# EAGLE design CMCD_and_buckmod_FINAL (EAGLE 6.2)

## Sheet 1 of 2
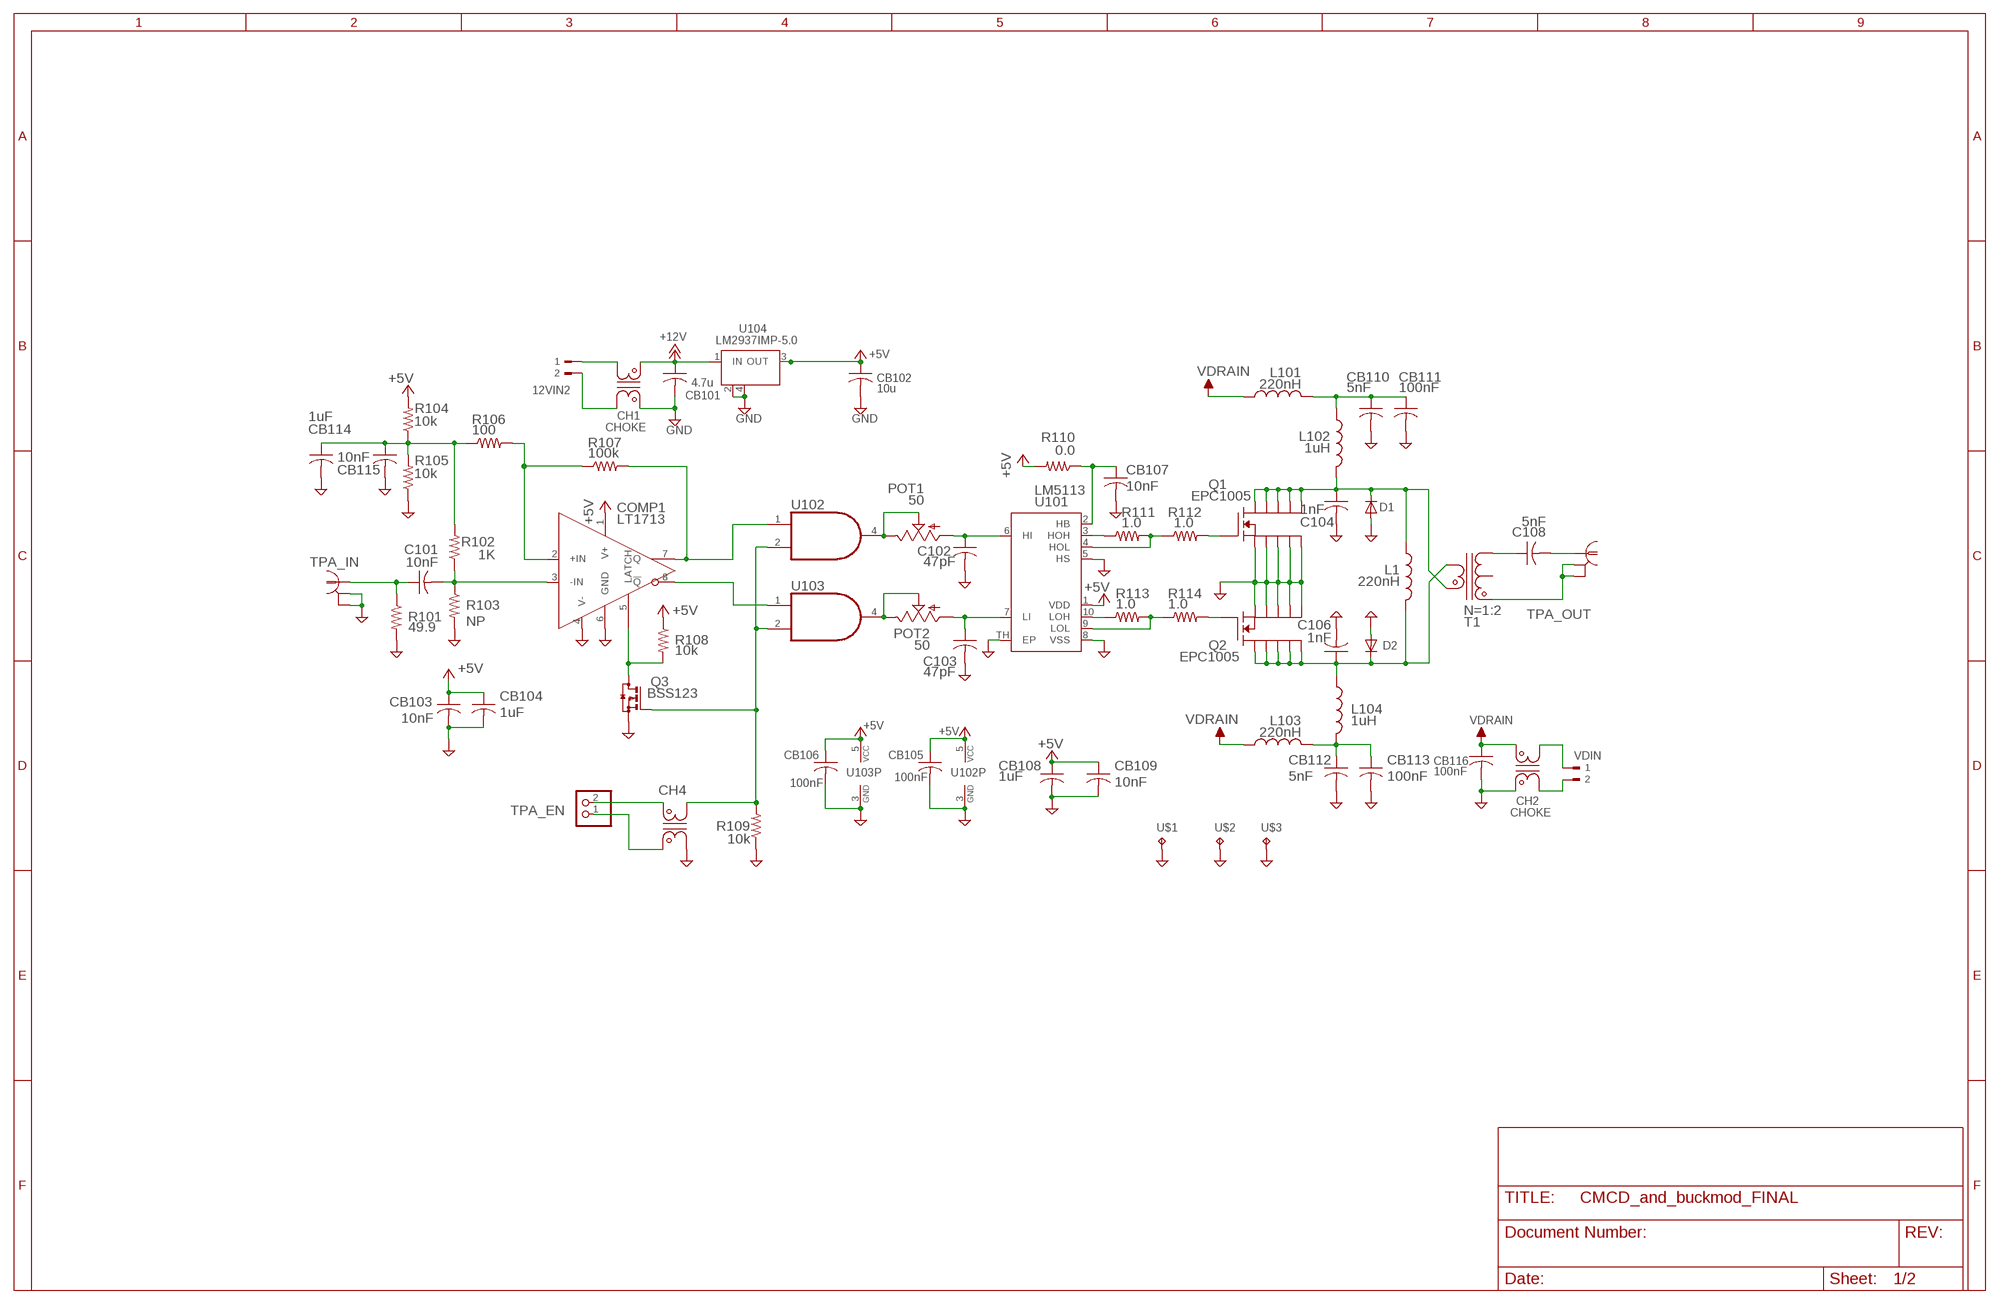
[diagram p0: schematic, sheet 1]

### Parts
12VIN2  TERM-2OMNIMATE_SL  [OMNIMATE_SL_2POS]
C101  10nF  C-USC0805  [C0805]
C102  47pF  C-USC0805  [C0805]
C103  47pF  C-USC0805  [C0805]
C104  1nF  CAPACITOR1008  [1008]
C106  1nF  CAPACITOR1008  [1008]
C108  5nF  CAPACITOR1008  [1008]
CB101  4.7u  C-USC0805  [C0805]
CB102  10u  C-USC0805  [C0805]
CB103  10nF  C-USC0603  [C0603]
CB104  1uF  C-USC0603  [C0603]
CB105  100nF  C-USC0603  [C0603]
CB106  100nF  C-USC0603  [C0603]
CB107  10nF  C-USC0603  [C0603]
CB108  1uF  C-USC0603  [C0603]
CB109  10nF  C-USC0603  [C0603]
CB110  5nF  CAPACITOR1008  [1008]
CB111  100nF  C-USC0805  [C0805]
CB112  5nF  CAPACITOR1008  [1008]
CB113  100nF  C-USC0805  [C0805]
CB114  1uF  C-USC0805  [C0805]
CB115  10nF  C-USC0603  [C0603]
CB116  100nF  C-USC0805  [C0805]
CH1  CHOKE  [CHOKE_DLW5BT]
CH2  CHOKE  [CHOKE_DLW5BT]
CH4  CHOKEDLW31S  [CHOKE_DLW31S]
COMP1  LT1713  [MSOP-8]
D1  DIODE-DO214AC  [DO214AC]
D2  DIODE-DO214AC  [DO214AC]
L1  220nH  INDUCTOR  [GENERAL-1]
L101  220nH  INDUCTOR  [GENERAL-1]
L102  1uH  INDUCTOR  [GENERAL-1]
L103  220nH  INDUCTOR  [GENERAL-1]
L104  1uH  INDUCTOR  [GENERAL-1]
POT1  50  TRIM_US-3223W  [3223W]
POT2  50  TRIM_US-3223W  [3223W]
Q1  EPC1005  [11-LGA]
Q2  EPC1005  [11-LGA]
Q3  BSS123  [SOT23]
R101  49.9  R-US_R0805  [R0805]
R102  1K  R-US_R0805  [R0805]
R103  NP  R-US_R0805  [R0805]
R104  10k  R-US_R0805  [R0805]
R105  10k  R-US_R0805  [R0805]
R106  100  R-US_R0805  [R0805]
R107  100k  R-US_R0805  [R0805]
R108  10k  R-US_R0805  [R0805]
R109  10k  R-US_R0805  [R0805]
R110  0.0  R-US_R0603  [R0603]
R111  1.0  R-US_R0603  [R0603]
R112  1.0  R-US_R0603  [R0603]
R113  1.0  R-US_R0603  [R0603]
R114  1.0  R-US_R0603  [R0603]
T1  N=1:2  BALUN_2:1BALUN_CUSTOM_BIG  [BALUN_GENERAL_BIG]
TPA_EN  PINHD-1X2  [1X02]
TPA_IN  BNC-EDGE  [BNC-EDGE]
TPA_OUT  BNC-EDGE  [BNC-EDGE]
U101  LM5113  [LLP-10]
U102  74AHC1G08DBV  [SOT23-5]
U103  74AHC1G08DBV  [SOT23-5]
U104  LM2937IMP-5.0  LM340S  [SOT223]
U$1  TESTPOINTKEYSTONE_ELECTRONICS_5016  [SMD_TESTPAD]
U$2  TESTPOINTKEYSTONE_ELECTRONICS_5016  [SMD_TESTPAD]
U$3  TESTPOINTKEYSTONE_ELECTRONICS_5016  [SMD_TESTPAD]
VDIN  TERM-2OMNIMATE_SL  [OMNIMATE_SL_2POS]

### Nets
+5V: CB102.1 CB103.1 CB104.1 CB105.1 CB106.1 CB108.1 CB109.1 COMP1.1(V+) R104.2 R108.1 R110.2 U101.1(VDD) U102.5(VCC) U103.5(VCC) U104.3(OUT) ; also sheet 2
+12V: CB101.1 CH1.P$4 U104.1(IN) ; also sheet 2
GND: C102.2 C103.2 C104.P$2 C106.P$2 CB101.2 CB102.2 CB103.2 CB104.2 CB105.2 CB106.2 CB107.2 CB108.2 CB109.2 CB110.P$2 CB111.2 CB112.P$2 CB113.2 CB114.2 CB115.2 CB116.2 CH1.P$1 CH2.P$1 CH4.P$2 COMP1.4(V-) COMP1.6(GND) D1.A D2.A Q1.2(S1) Q1.4(S2) Q1.6(S3) Q1.8(S4) Q1.10(S5) Q2.2(S1) Q2.4(S2) Q2.6(S3) Q2.8(S4) Q2.10(S5) Q3.2(S) R101.2 R103.2 R105.1 R109.1 TPA_IN.S1(GND1) TPA_IN.S2(GND2) U101.5(HS) U101.8(VSS) U101.TH(EP) U102.3(GND) U103.3(GND) U104.2(GND) U104.4(GND) U$1.P$1(TP) U$2.P$1(TP) U$3.P$1(TP) ; also sheet 2
N$1: R111.1 U101.3(HOH)
N$2: R111.2 R112.1 U101.4(HOL)
N$3: R113.1 U101.10(LOH)
N$4: R113.2 R114.1 U101.9(LOL)
N$5: Q2.1(G) R114.2
N$6: Q1.1(G) R112.2
N$7: CB107.1 R110.1 U101.2(HB)
N$8: COMP1.7(Q) R107.2 U102.1(I0)
N$9: POT1.2(S) POT1.3(E) U102.4(O)
N$10: POT2.2(S) POT2.3(E) U103.4(O)
N$11: CB114.1 CB115.1 R102.2 R104.1 R105.2 R106.1
N$12: COMP1.8(!Q) U103.1(I0)
N$13: COMP1.5(LATCH) Q3.3(D) R108.2
N$14: T1.S1 TPA_OUT.S1(GND1) TPA_OUT.S2(GND2)
N$15: C102.1 POT1.1(A) U101.6(HI)
N$16: COMP1.2(+IN) R106.2 R107.1
N$17: C101.2 COMP1.3(-IN) R102.1 R103.1
N$18: C101.1 R101.1 TPA_IN.I
N$19: CH4.P$3 Q3.1(G) R109.2 U102.2(I1) U103.2(I1)
N$22: CH2.P$3 VDIN.1
N$23: CH2.P$2 VDIN.2
N$24: C106.P$1 D2.C L1.P$2 L104.P$1 Q2.3(D1) Q2.5(D2) Q2.7(D3) Q2.9(D4) Q2.11(D5) T1.P2
N$25: C103.1 POT2.1(A) U101.7(LI)
N$26: C104.P$1 D1.C L1.P$1 L102.P$2 Q1.3(D1) Q1.5(D2) Q1.7(D3) Q1.9(D4) Q1.11(D5) T1.P1
N$27: CB110.P$1 CB111.1 L101.P$2 L102.P$1
N$28: CB112.P$1 CB113.1 L103.P$2 L104.P$2
N$29: C108.P$2 TPA_OUT.I
N$31: C108.P$1 T1.S2
N$33: 12VIN2.1 CH1.P$3
N$34: 12VIN2.2 CH1.P$2
N$39: CH4.P$4 TPA_EN.2
N$40: CH4.P$1 TPA_EN.1
VDRAIN: CB116.1 CH2.P$4 L101.P$1 L103.P$1
Unconnected: T1.CT

## Sheet 2 of 2
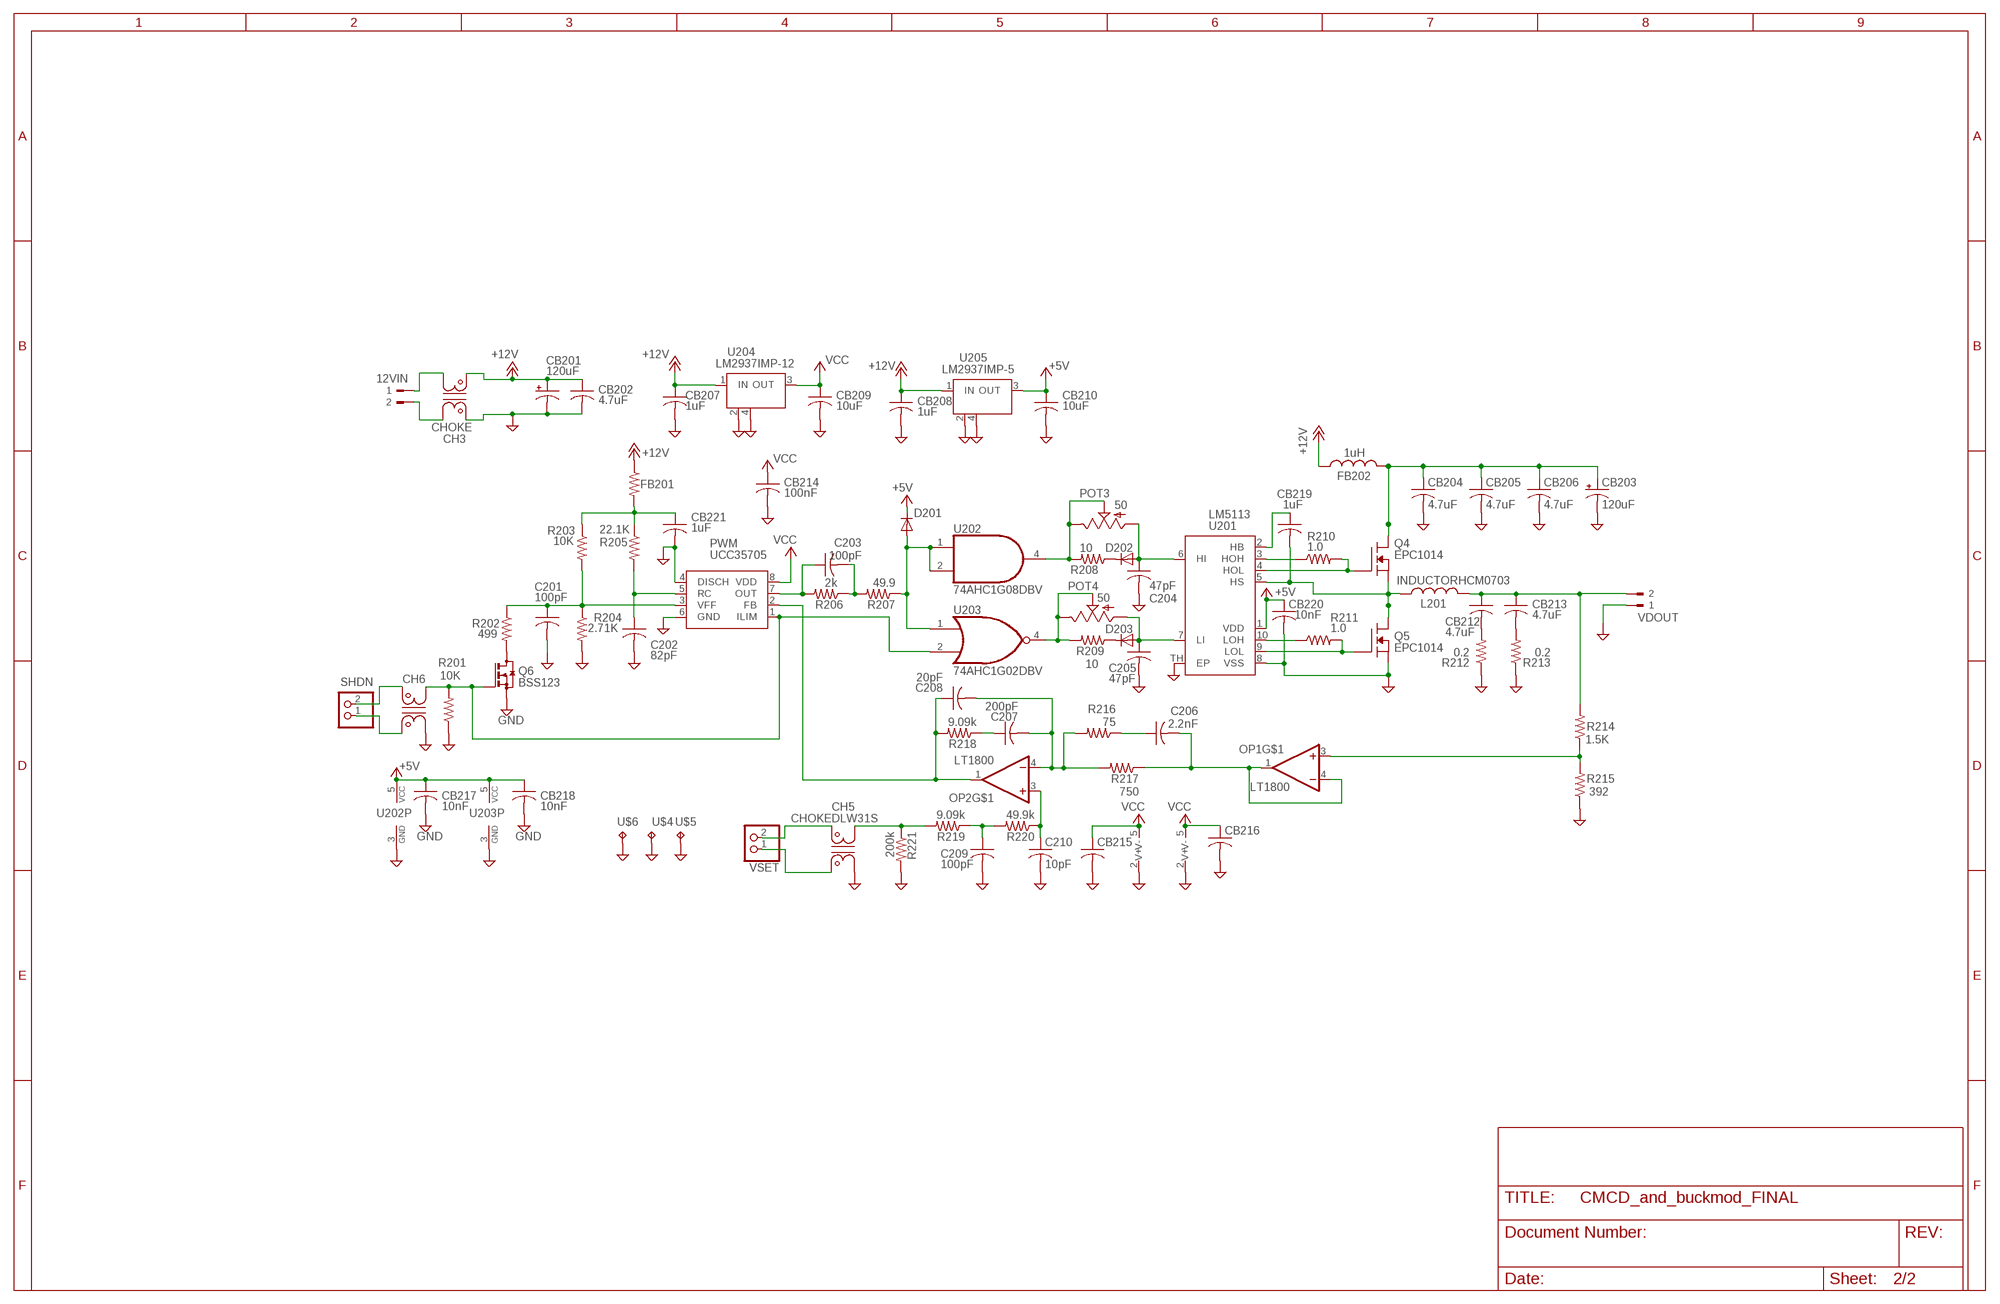
[diagram p1: schematic, sheet 2]

### Parts
12VIN  TERM-2OMNIMATE_SL  [OMNIMATE_SL_2POS]
C201  100pF  C-USC0805  [C0805]
C202  82pF  C-USC0805  [C0805]
C203  100pF  C-USC0805  [C0805]
C204  47pF  C-USC0603  [C0603]
C205  47pF  C-USC0603  [C0603]
C206  2.2nF  C-USC0805  [C0805]
C207  200pF  C-USC0805  [C0805]
C208  20pF  C-USC0805  [C0805]
C209  100pF  C-USC0805  [C0805]
C210  10pF  C-USC0805  [C0805]
CB201  120uF  CPOL-USE3.5-8  [E3,5-8]
CB202  4.7uF  C-USC0805  [C0805]
CB203  120uF  CPOL-USE3.5-8  [E3,5-8]
CB204  4.7uF  C-USC0805  [C0805]
CB205  4.7uF  CAPACITOR1206-LONG  [1206-LONG]
CB206  4.7uF  CAPACITOR1206-LONG  [1206-LONG]
CB207  1uF  C-USC0805  [C0805]
CB208  1uF  C-USC0805  [C0805]
CB209  10uF  C-USC0805  [C0805]
CB210  10uF  C-USC0805  [C0805]
CB212  4.7uF  C-USC0805  [C0805]
CB213  4.7uF  C-USC0805  [C0805]
CB214  100nF  C-USC0603  [C0603]
CB215  C-USC0603  [C0603]
CB216  C-USC0603  [C0603]
CB217  10nF  C-USC0603  [C0603]
CB218  10nF  C-USC0603  [C0603]
CB219  1uF  C-USC0603  [C0603]
CB220  10nF  C-USC0603  [C0603]
CB221  1uF  C-USC0805  [C0805]
CH3  CHOKE  [CHOKE_DLW5BT]
CH5  CHOKEDLW31S  [CHOKE_DLW31S]
CH6  CHOKEDLW31S  [CHOKE_DLW31S]
D201  DIODE-SOD323-W  [SOD323-W]
D202  DIODE-SOD323-W  [SOD323-W]
D203  DIODE-SOD323-W  [SOD323-W]
FB201  R-US_R0805  [R0805]
FB202  1uH  INDUCTOR1008  [1008]
L201  INDUCTORHCM0703  [HCM0703]
OP1  LT1800  LMH6624  [SOT23-5]
OP2  LT1800  LMH6624  [SOT23-5]
POT3  50  TRIM_US-3223W  [3223W]
POT4  50  TRIM_US-3223W  [3223W]
PWM  UCC35705  [MSOP-8]
Q4  EPC1014  [5-LGA]
Q5  EPC1014  [5-LGA]
Q6  BSS123  [SOT23]
R201  10K  R-US_R0805  [R0805]
R202  499  R-US_R0805  [R0805]
R203  10K  R-US_R0805  [R0805]
R204  2.71K  R-US_R0805  [R0805]
R205  22.1K  R-US_R0805  [R0805]
R206  2k  R-US_R0805  [R0805]
R207  49.9  R-US_R0805  [R0805]
R208  10  R-US_R0805  [R0805]
R209  10  R-US_R0805  [R0805]
R210  1.0  R-US_R0603  [R0603]
R211  1.0  R-US_R0603  [R0603]
R212  0.2  R-US_R0805  [R0805]
R213  0.2  R-US_R0805  [R0805]
R214  1.5K  R-US_R0805  [R0805]
R215  392  R-US_R0805  [R0805]
R216  75  R-US_R0805  [R0805]
R217  750  R-US_R0805  [R0805]
R218  9.09k  R-US_R0805  [R0805]
R219  9.09k  R-US_R0805  [R0805]
R220  49.9k  R-US_R0805  [R0805]
R221  200k  R-US_R0805  [R0805]
SHDN  PINHD-1X2  [1X02]
U201  LM5113  [LLP-10]
U202  74AHC1G08DBV  [SOT23-5]
U203  74AHC1G02DBV  [SOT23-5]
U204  LM2937IMP-12  LM340S  [SOT223]
U205  LM2937IMP-5  LM340S  [SOT223]
U$4  TESTPOINTKEYSTONE_ELECTRONICS_5016  [SMD_TESTPAD]
U$5  TESTPOINTKEYSTONE_ELECTRONICS_5016  [SMD_TESTPAD]
U$6  TESTPOINTKEYSTONE_ELECTRONICS_5016  [SMD_TESTPAD]
VDOUT  TERM-2OMNIMATE_SL  [OMNIMATE_SL_2POS]
VSET  PINHD-1X2  [1X02]

### Nets
+5V: CB210.1 CB217.1 CB218.1 CB220.1 D201.C U201.1(VDD) U202.5(VCC) U203.5(VCC) U205.3(OUT) ; also sheet 1
+12V: CB201.+ CB202.1 CB207.1 CB208.1 CH3.P$4 FB201.1 FB202.P$1 U204.1(IN) U205.1(IN) ; also sheet 1
+VIN: CB203.+ CB204.1 CB205.1 CB206.1 FB202.P$2 Q4.3(D) Q4.5(D1)
GND: C201.2 C202.2 C204.2 C205.2 C209.2 C210.2 CB201.- CB202.2 CB203.- CB204.2 CB205.2 CB206.2 CB207.2 CB208.2 CB209.2 CB210.2 CB214.2 CB215.2 CB216.2 CB217.2 CB218.2 CB220.2 CB221.2 CH3.P$1 CH5.P$2 CH6.P$2 OP1.2(V-) OP2.2(V-) PWM.4(DISCH) PWM.6(GND) Q5.2(S1) Q5.4(S2) Q6.2(S) R201.1 R204.2 R212.1 R213.1 R215.1 R221.2 U201.8(VSS) U201.TH(EP) U202.3(GND) U203.3(GND) U204.2(GND) U204.4(GND) U205.2(GND) U205.4(GND) U$4.P$1(TP) U$5.P$1(TP) U$6.P$1(TP) VDOUT.1 ; also sheet 1
N$20: 12VIN.2 CH3.P$2
N$21: 12VIN.1 CH3.P$3
N$30: R210.1 U201.3(HOH)
N$32: Q4.1(G) R210.2 U201.4(HOL)
N$35: CH5.P$4 VSET.2
N$36: CH5.P$1 VSET.1
N$37: CH6.P$4 SHDN.2
N$38: CH6.P$1 SHDN.1
N$45: R211.1 U201.10(LOH)
N$81: Q5.1(G) R211.2 U201.9(LOL)
N$82: CB219.2 L201.P$1 Q4.2(S1) Q4.4(S2) Q5.3(D) Q5.5(D1) U201.5(HS)
N$83: C205.1 D203.A POT4.1(A) U201.7(LI)
N$84: C204.1 D202.A POT3.1(A) U201.6(HI)
N$85: POT4.2(S) POT4.3(E) R209.2 U203.4(O)
N$86: CB219.1 U201.2(HB)
N$87: C208.1 OP2.1(OUT) PWM.2(FB) R218.2
N$88: C207.2 C208.2 OP2.4(-IN) R216.2 R217.2
N$89: C207.1 R218.1
N$90: C206.1 R216.1
N$91: C206.2 OP1.1(OUT) OP1.4(-IN) R217.1
N$92: CB213.2 R213.2
N$93: CB212.1 CB213.1 L201.P$2 R214.2 VDOUT.2
N$94: OP1.3(+IN) R214.1 R215.2
N$96: C209.1 R219.1 R220.2
N$97: CB212.2 R212.2
N$104: CH5.P$3 R219.2 R221.1
N$107: D201.A R207.1 U202.1(I0) U202.2(I1) U203.1(I0)
N$108: C202.1 PWM.5(RC) R205.2
N$109: C201.1 PWM.3(VFF) R202.1 R203.2 R204.1
N$111: C203.1 PWM.7(OUT) R206.2
N$112: C203.2 R206.1 R207.2
N$113: Q6.3(D) R202.2
N$114: CB221.1 FB201.2 R203.1 R205.1
N$116: D203.C R209.1
N$117: D202.C R208.1
N$129: POT3.2(S) POT3.3(E) R208.2 U202.4(O)
N$135: CH6.P$3 PWM.1(ILIM) Q6.1(G) R201.2 U203.2(I1)
OP2: C210.1 OP2.3(+IN) R220.1
VCC: CB209.1 CB214.1 CB215.1 CB216.1 OP1.5(V+) OP2.5(V+) PWM.8(VDD) U204.3(OUT)

## Library data of the parts
12VIN 12VIN2 VDIN VDOUT = amyparts-rf-combined:TERM-2
C101-C103 C201-C210 CB101-CB109 CB111 CB113-CB116 CB202 CB204 CB207-CB210 CB212-CB221 = rcl:C-US: CAPACITOR, American symbol
C104 C106 C108 CB110 CB112 CB205 CB206 = amyparts-rf-combined:CAPACITOR
CB201 CB203 = rcl:CPOL-US: POLARIZED CAPACITOR, American symbol
CH1-CH6 = amyparts-rf-combined:CHOKE
COMP1 = amyparts-rf-combined:LT1713
D1 D2 D201-D203 = diode:DIODE-: DIODE
FB201 R101-R114 R201-R221 = rcl:R-US_: RESISTOR, American symbol
FB202 = amyparts-rf:INDUCTOR
L1 L101-L104 L201 = amyparts-rf-combined:INDUCTOR
OP1 OP2 = amyparts-rf:LMH6624
POT1-POT4 = amyparts-rf-combined:TRIM_US-: POTENTIOMETER
PWM = amyparts-rf-combined:UCC35705
Q1 Q2 = amyparts-rf-combined:EPC1005
Q3 Q6 = transistor-small-signal:BSS123: N-CHANNEL MOS FET
Q4 Q5 = amyparts-rf:EPC1014
SHDN TPA_EN VSET = pinhead:PINHD-1X2: PIN HEADER
T1 = amyparts-rf-combined:BALUN_2:1
TPA_IN TPA_OUT = amyparts-rf-combined:BNC-EDGE
U101 = amyparts-rf-combined:LM5113
U102 U103 U202 = 74xx-little-us:74*1G08: 2-input AND gate
U104 U204 U205 = linear:LM340S: 3-Terminal Positive Regulators Source: http://cache.national.com/ds/LM/LM340.pdf
U201 = amyparts-rf:LM5113
U203 = 74xx-little-us:74*1G02: 2-input NOR gate
U$1-U$6 = amyparts-rf-combined:TESTPOINT

## Board
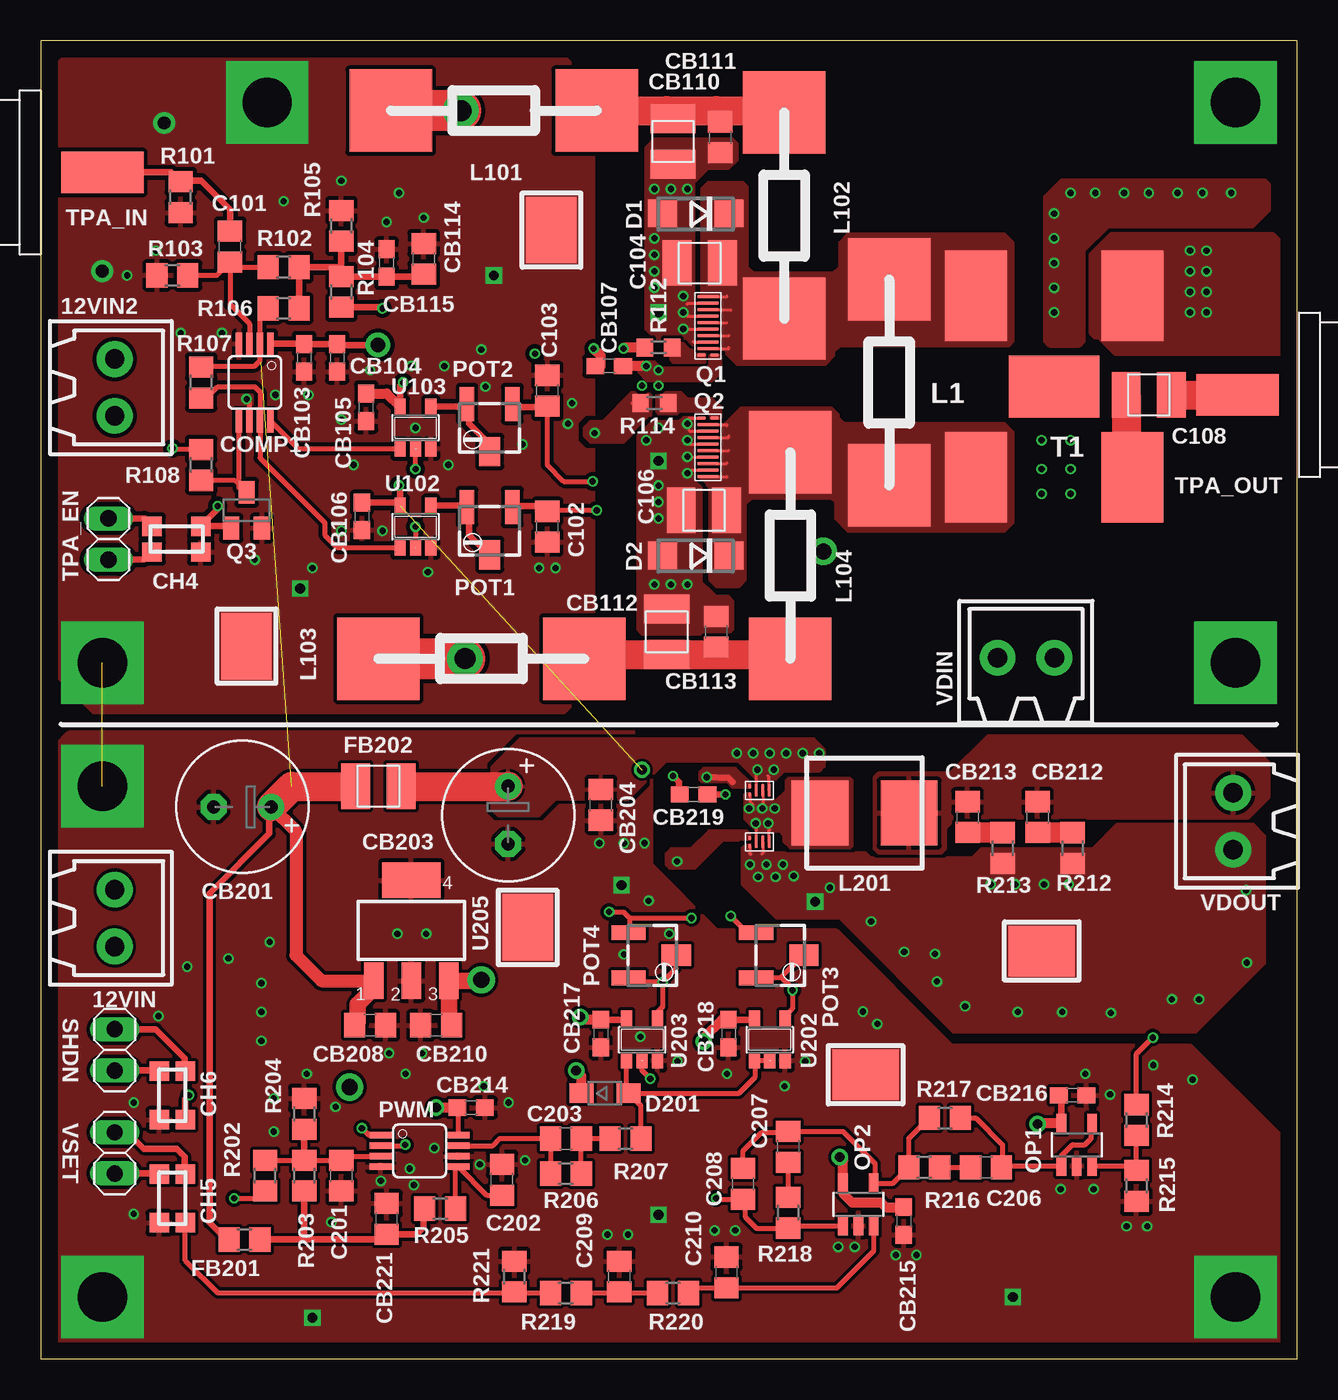
[diagram p2: board, top side]
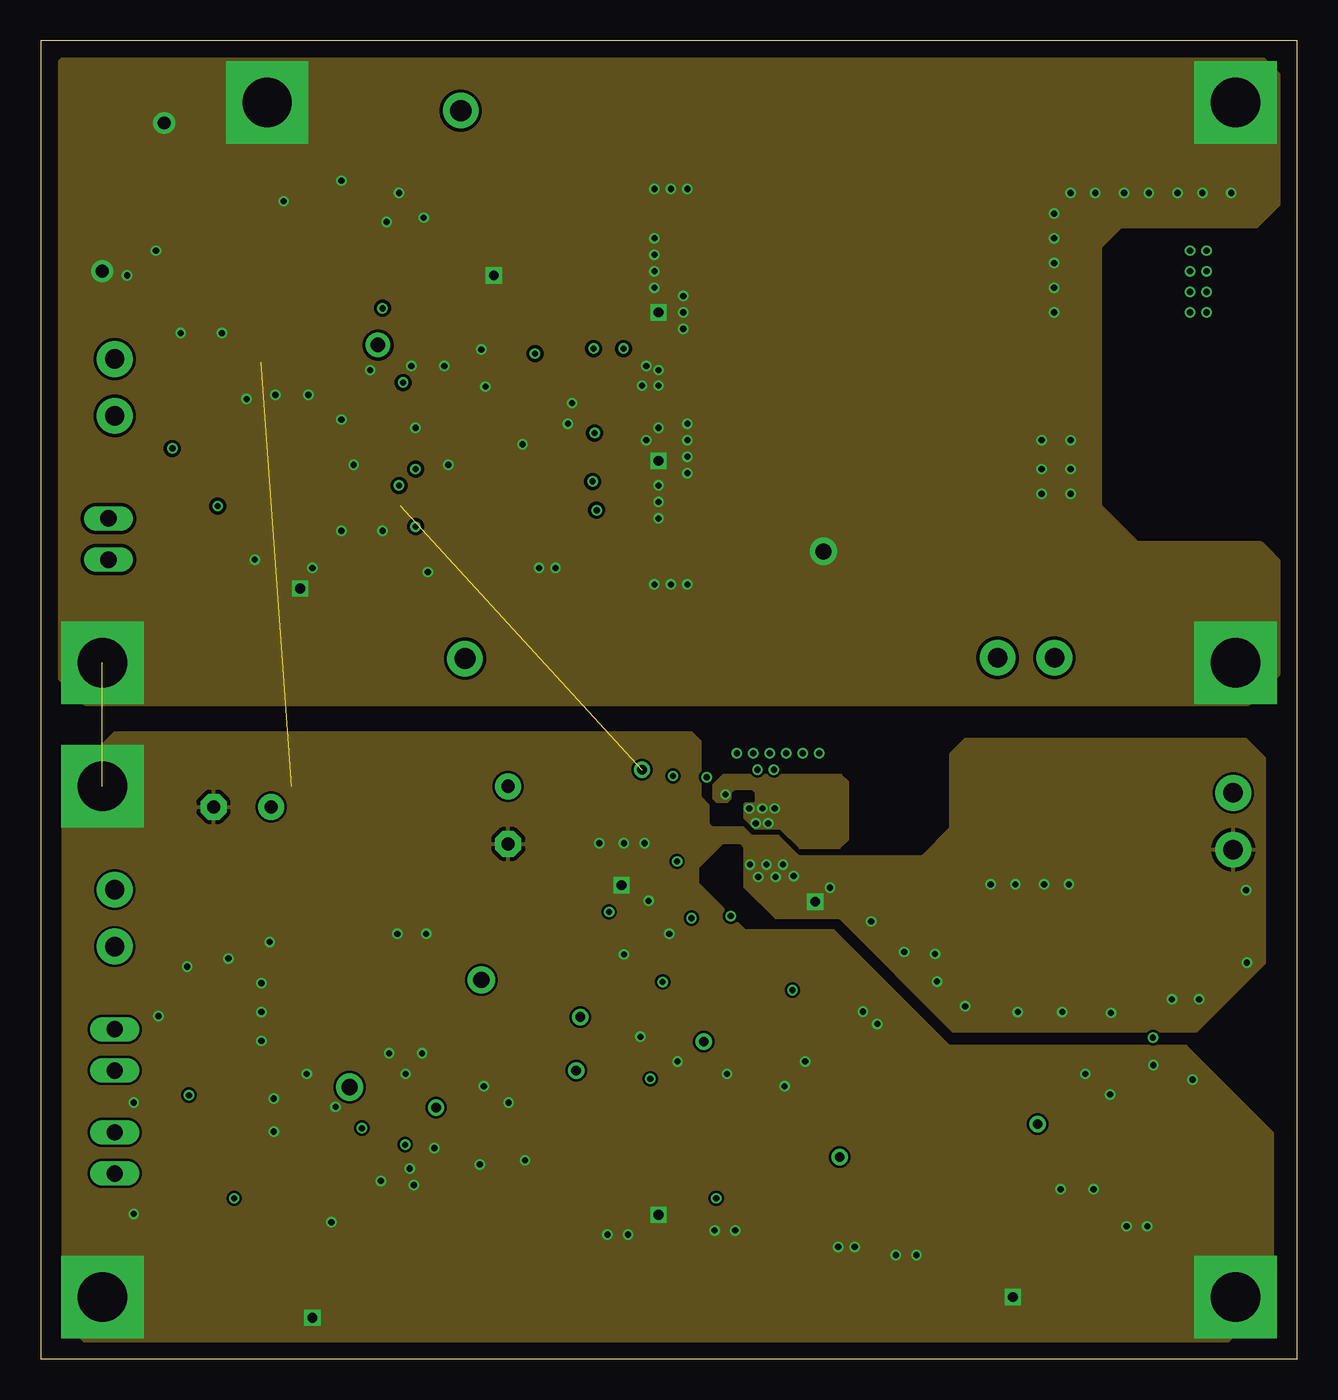
[diagram p3: board, inner layer Route2]
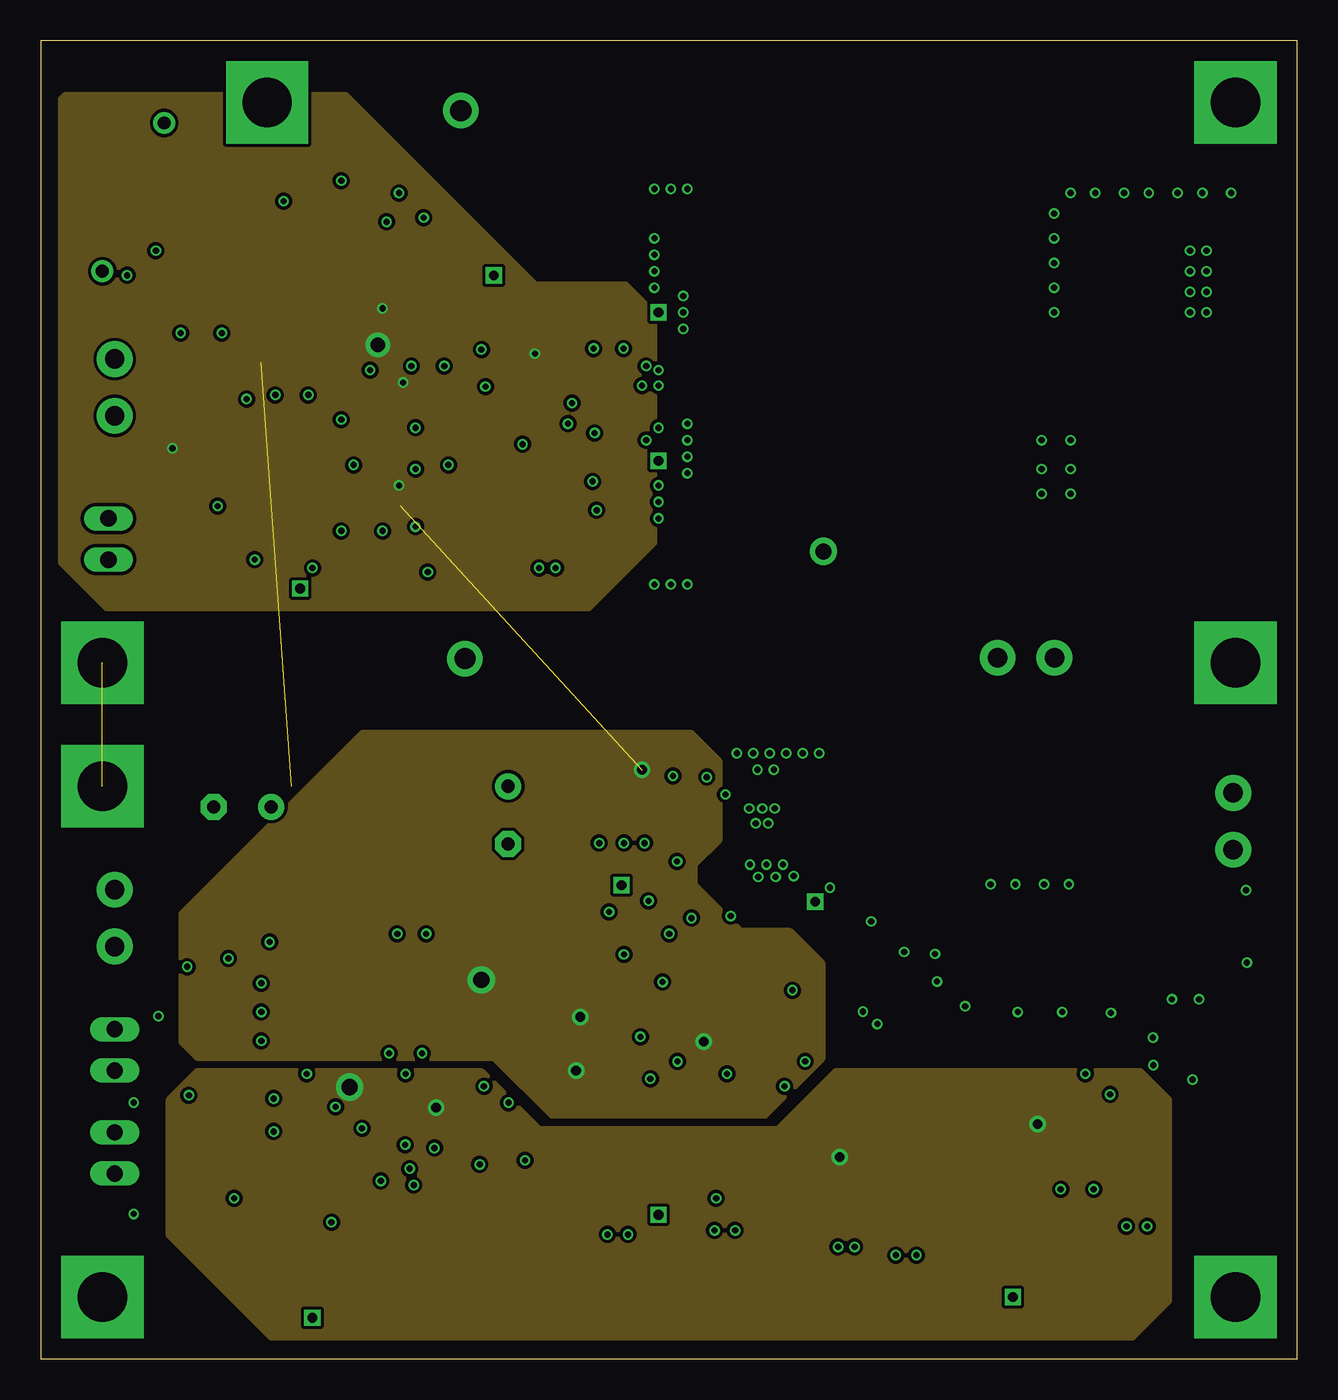
[diagram p4: board, inner layer Route15]
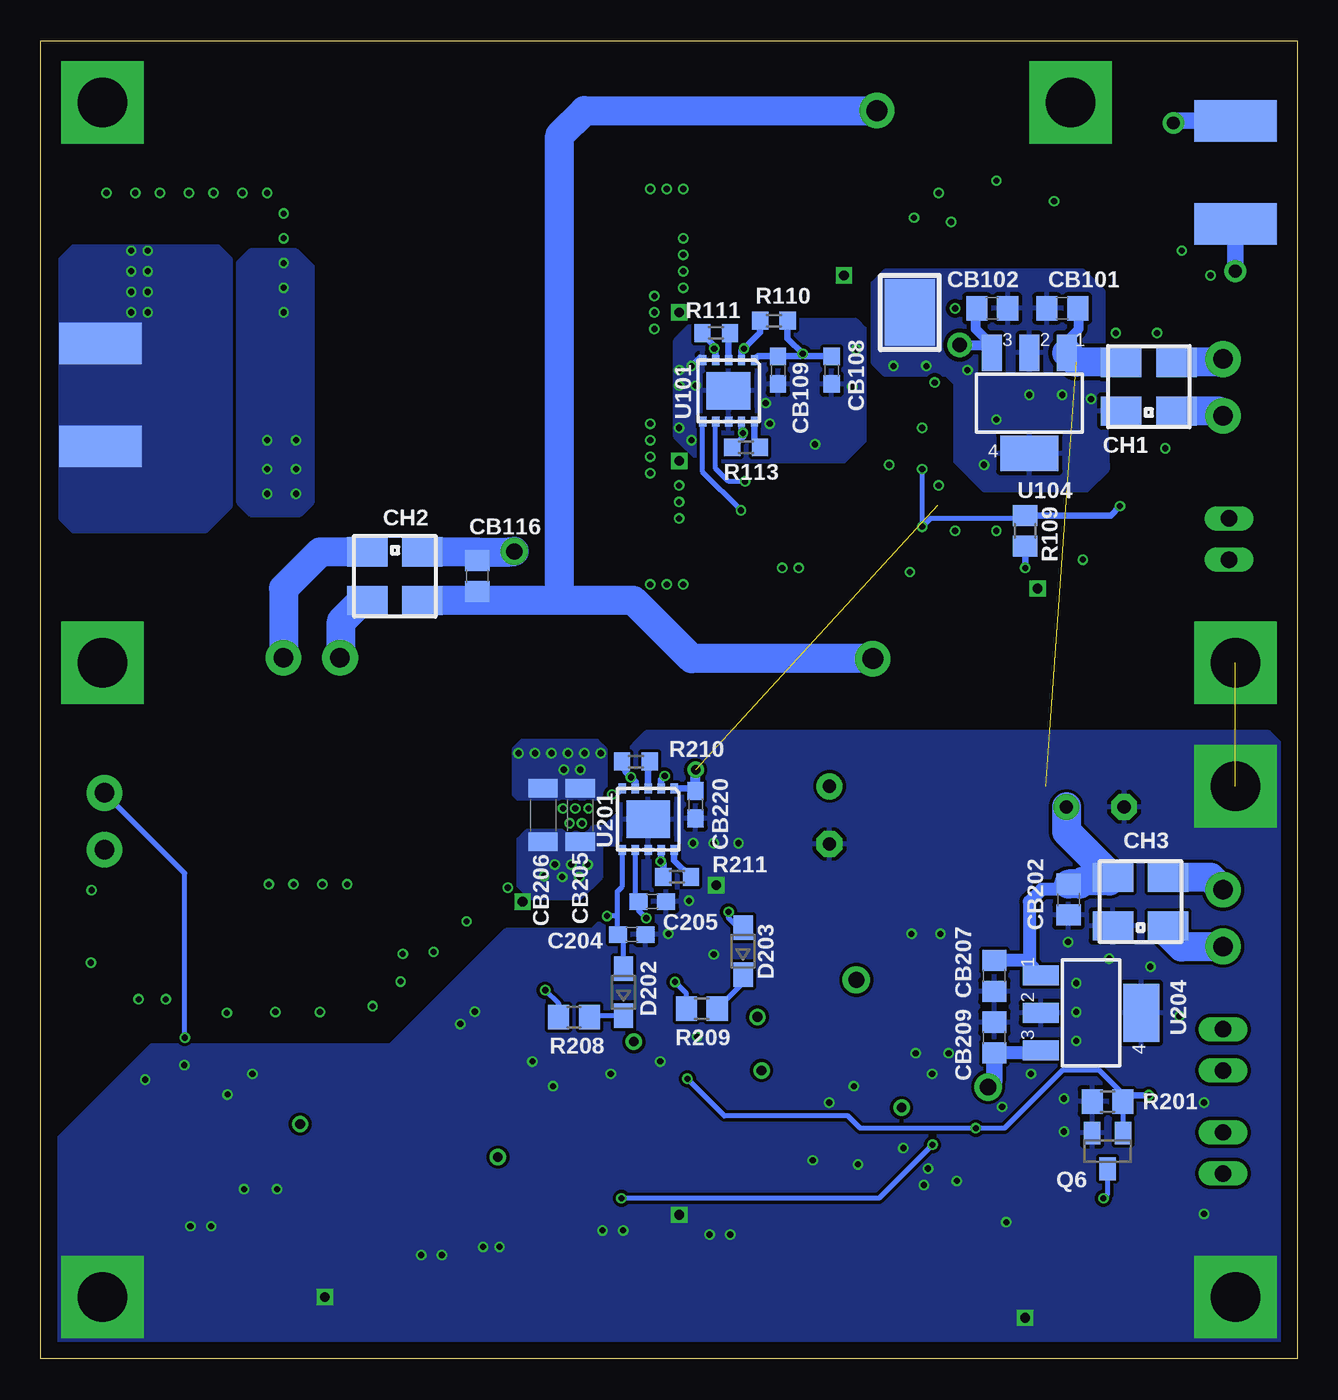
[diagram p5: board, bottom side, seen from below]

Size 77.47 x 81.28 mm. Coordinates in mm from the lower left corner, seen from the top.
Outline: 0,0 77.47,0 77.47,81.28 0,81.28 0,0
Copper layers (1*2+15*16): Top 0.035mm / dielectric 1.5mm / Route2 0.035mm / dielectric 0.15mm / Route15 0.035mm / dielectric 0.2mm / Bottom 0.035mm
Design rules: minimum track width 7mil, minimum drill 15mil, track to track 6mil, track to pad 6mil, pad to pad 6mil, via to via 6mil, smd to smd 1mil, copper to edge 40mil, drill to drill 8mil, minimum pad ring 7mil, minimum via ring 5mil, stop-mask expansion 4mil, vias tented up to drill 15mil, thermal gap 10mil

### Footprints (pad centres in the part's own frame; a part is rotated, then mirrored left to right if it is on the bottom)
OMNIMATE_SL_2POS = drill 1.2 pad 2.2: 1 -1.75,0; 2 1.75,0
C0805 = smd 1.3 x 1.5: 1 -0.95,0; 2 0.95,0
1008 = smd 1.778 x 2.794: P$1 -1.397,0; P$2 1.397,0
C0603 = smd 1.1 x 1: 1 -0.85,0; 2 0.85,0
E3,5-8 = drill 0.813 pad 1.6: + -1.778,0 | drill 0.813 pad 1.6 octagon: - 1.778,0
1206-LONG = smd 1.143 x 1.8: 1 -1.651,0; 2 1.651,0
CHOKE_DLW5BT = smd 2.5 x 1.8: P$1 -1.7,-1.5; P$2 1.7,-1.5; P$3 1.7,1.5; P$4 -1.7,1.5
CHOKE_DLW31S = smd 1.2 x 1.2: P$1 -1.5,-0.8; P$2 1.5,-0.8; P$3 1.5,0.8; P$4 -1.5,0.8
MSOP-8 = smd 0.4 x 1.397: 1 -0.976,-2.39; 2 -0.326,-2.39; 3 0.324,-2.39; 4 0.974,-2.39; 5 0.974,2.389; 6 0.324,2.389; 7 -0.326,2.389; 8 -0.976,2.389
DO214AC = smd 1.8 x 1.7: A 2.05,0; C -2.05,0
SOD323-W = smd 1.5 x 1.2: A 1.45,0; C -1.45,0
R0805 = smd 1.3 x 1.5: 1 -0.95,0; 2 0.95,0
GENERAL-1 = smd 5.08 x 5.08: P$1 0,6.35; P$2 0,-6.35
HCM0703 = smd 4 x 3.5: P$1 0,2.75; P$2 0,-2.75
SOT23-5 = smd 0.6 x 1.2: 1 -0.95,-1.306; 2 0,-1.306; 3 0.95,-1.306; 4 0.95,1.306; 5 -0.95,1.306
3223W = smd 0.9 x 2.108: 1 -1.4,-1.469; 3 1.4,-1.469 | smd 1.3 x 1.808: 2 0,1.469
11-LGA = smd 0.2 x 0.53: 1 -0.6,0.401; 2 -0.6,-0.401 | smd 0.2 x 1.33: 3 -0.2,0; 4 0.2,0; 5 0.6,0; 6 1,0; 7 1.4,0; 8 1.8,0; 9 2.2,0; 10 2.6,0; 11 3,0
SOT23 = smd 1 x 1.4: 1 -0.95,-1.1; 2 0.95,-1.1; 3 0,1.1
5-LGA = smd 0.2 x 0.28: 1 -0.6,0.251; 2 -0.6,-0.251 | smd 0.2 x 0.79: 3 -0.2,0; 4 0.2,0; 5 0.6,0
R0603 = smd 1 x 1.1: 1 -0.85,0; 2 0.85,0
1X02 = drill 1.016 long: 1 -1.27,0; 2 1.27,0
BALUN_GENERAL_BIG = smd 5.588 x 3.81: CT 0,0 | smd 3.81 x 5.588: P1 -4.826,5.588; P2 -4.826,-5.588; S1 4.826,5.588; S2 4.826,-5.588
BNC-EDGE = smd 5.08 x 2.54: I 2.54,0 | smd 5.08 x 2.54 bottom: S1 2.54,3.175; S2 2.54,-3.175
LLP-10 = smd 0.45 x 0.61: 1 -1.6,-1.9; 2 -0.8,-1.9; 3 0,-1.9; 4 0.8,-1.9; 5 1.6,-1.9; 6 1.6,1.9; 7 0.8,1.9; 8 0,1.9; 9 -0.8,1.9; 10 -1.6,1.9 | smd 2.7 x 2.3: TH 0,0
SOT23-5' = smd 0.69 x 0.99: 1 -0.95,-1.29; 2 0,-1.29; 3 0.95,-1.29; 4 0.95,1.3; 5 -0.95,1.3
SOT223 = smd 1.219 x 2.235: 1 -2.311,-3.099; 2 0,-3.099; 3 2.311,-3.099 | smd 3.6 x 2.2: 4 0,3.099
SMD_TESTPAD = smd 4.1 x 3.1: P$1 0,0

### Placement (x,y rotation side)
12VIN  4.57,27.18 270 top
12VIN2  4.57,59.89 270 top
C101  11.68,68.58 270 top
C102  31.24,51.31 270 top
C103  31.24,59.69 90 top
C104  40.64,67.56 180 top
C106  40.89,52.32 180 top
C108  68.33,59.44 0 top
C201  18.54,11.3 270 top
C202  28.45,11.05 90 top
C203  32.38,13.59 0 top
C204  41.02,26.16 0 bottom
C205  39.75,28.19 0 bottom
C206  58.29,11.81 0 top
C207  46.1,13.08 90 top
C208  43.31,10.79 90 top
C209  35.69,5.08 90 top
C210  42.29,5.33 90 top
CB101  14.48,64.77 180 bottom
CB102  18.8,64.77 0 bottom
CB103  16.26,61.72 270 top
CB104  18.29,61.72 270 top
CB105  20.07,58.67 270 top
CB106  19.81,51.94 270 top
CB107  35.05,61.21 0 top
CB108  28.7,60.96 270 bottom
CB109  32,60.96 270 bottom
CB110  38.99,75.06 270 top
CB111  41.91,75.31 270 top
CB112  38.61,44.83 90 top
CB113  41.66,44.83 90 top
CB114  23.62,67.82 90 top
CB115  21.34,67.56 90 top
CB116  50.55,48.26 90 bottom
CB201  12.45,34.04 180 top
CB202  14.1,28.32 270 bottom
CB203  28.83,33.53 270 top
CB204  34.54,34.16 270 top
CB205  44.2,33.53 270 bottom
CB206  46.48,33.53 270 bottom
CB207  18.67,23.62 270 bottom
CB208  20.32,20.57 0 top
CB209  18.67,19.81 90 bottom
CB210  24.38,20.57 180 top
CB212  61.47,33.4 270 top
CB213  57.15,33.4 270 top
CB214  26.54,15.49 0 top
CB215  53.21,8.51 270 top
CB216  63.63,16.26 0 top
CB217  34.54,20.07 270 top
CB218  42.42,20.07 270 top
CB219  40.26,34.8 0 top
CB220  37.08,34.16 270 bottom
CB221  21.34,8.64 90 top
CH1  9.14,59.94 0 bottom
CH2  55.63,48.26 180 bottom
CH3  9.65,28.19 0 bottom
CH4  8.38,50.55 0 top
CH5  8.13,9.91 270 top
CH6  8.13,16.26 270 top
COMP1  13.21,60.2 180 top
D1  40.39,70.61 180 top
D2  40.39,49.53 180 top
D201  34.8,16.38 0 top
D202  41.53,22.61 90 bottom
D203  34.16,25.15 90 bottom
FB201  12.57,7.37 0 top
FB202  20.83,35.31 0 top
L1  52.32,60.2 0 top
L101  27.94,76.96 90 top
L102  45.85,70.48 0 top
L103  27.18,43.18 90 top
L104  46.23,49.53 0 top
L201  50.8,33.66 90 top
OP1  63.88,13.21 0 top
OP2  50.42,9.53 0 top
POT1  27.69,51.05 180 top
POT2  27.69,57.4 180 top
POT3  45.59,24.89 270 top
POT4  37.72,24.89 270 top
PWM  23.37,12.83 270 top
Q1  41.15,62.48 90 top
Q2  41.15,57.4 270 top
Q3  12.7,52.32 0 top
Q4  44.32,35.05 0 top
Q5  44.32,31.88 0 top
Q6  11.68,12.83 180 bottom
R101  8.64,71.63 270 top
R102  14.99,67.31 0 top
R103  8.13,66.8 180 top
R104  18.54,65.79 270 top
R105  18.54,69.85 270 top
R106  14.99,64.77 180 top
R107  9.91,60.2 270 top
R108  9.91,55.12 270 top
R109  16.76,51.05 90 bottom
R110  32.26,64.01 0 bottom
R111  35.81,63.25 180 bottom
R112  38.1,62.36 0 top
R113  33.97,56.2 180 bottom
R114  37.85,58.93 0 top
R201  11.68,15.88 0 bottom
R202  13.84,11.3 270 top
R203  16.26,11.3 90 top
R204  16.26,15.11 90 top
R205  24.64,9.27 0 top
R206  32.38,11.43 180 top
R207  36.07,13.59 180 top
R208  44.58,21.08 180 bottom
R209  36.7,21.59 180 bottom
R210  40.77,36.83 180 bottom
R211  38.23,29.72 180 bottom
R212  63.63,31.5 90 top
R213  59.31,31.5 90 top
R214  67.56,14.73 90 top
R215  67.56,10.67 90 top
R216  54.48,11.81 180 top
R217  55.75,14.86 180 top
R218  46.1,9.02 270 top
R219  32.38,4.06 180 top
R220  38.99,4.06 180 top
R221  29.21,5.08 90 top
SHDN  4.57,19.05 90 top
T1  62.48,59.94 0 top
TPA_EN  4.19,50.55 90 top
TPA_IN  1.27,73.15 0 top
TPA_OUT  76.33,59.44 180 top
U101  35.05,59.69 180 bottom
U102  74AHC1G08DBV  [SOT23-5']  23.11,51.31 0 top
U103  74AHC1G08DBV  [SOT23-5']  23.11,57.4 0 top
U104  16.51,58.93 180 bottom
U201  40.01,33.27 180 bottom
U202  74AHC1G08DBV  [SOT23-5']  44.96,19.68 0 top
U203  74AHC1G02DBV  [SOT23-5']  37.08,19.68 0 top
U204  12.7,21.34 270 bottom
U205  22.86,26.42 0 top
U$1  50.86,17.53 0 top
U$2  30.04,26.61 90 top
U$3  61.72,25.15 0 top
U$4  31.5,69.6 90 top
U$5  12.7,43.94 90 top
U$6  23.88,64.52 270 bottom
VDIN  60.76,43.23 0 top
VDOUT  73.53,33.15 90 top
VSET  4.57,12.7 90 top

### Tracks (layer width: path | path; a pad name or v marks a point on that pad's centre or on a via)
+5V  (via drill 0.38, 0.6, 0.9, 1 pad 1.27)  (1 unrouted)
  Top 0.305: R108.1 8.19,56.07 v8.13,56.13
  Top 0.406: CB106.1 21.98,52.79 U102.5 22.16,53.78 v22.1,53.85 | CB218.1 43.94,20.92 U202.5 | CB217.1 36.06,20.92 U203.5 | R104.2 21.02,64.84 v21.08,64.77 | U103.5 22.16,60.01 v22.35,60.2 | COMP1.1 16.24,62.59 CB103.1 CB104.1 18.35,62.51 v20.8,62.51
  Top 0.61: U103.5 21.34,59.52 CB105.1 | CB217.1 33.44,20.92 v33.27,21.08 | CB218.1 42,20.92 40.89,19.81 v40.89,19.56 | D201.C 33.35,17.45 v33.02,17.78
  Top 1.016: CB210.1 25.17,20.74 U205.3 27.13,23.32 v27.18,23.37
  Bottom 0.406: U101.1 33.23,61.81 CB109.1 30.65,61.81 v30.48,61.98 | CB108.1 30.31,61.81 v30.48,61.98 | R110.2 31.41,62.9 v30.48,61.98 | U201.1 37.24,35.17 CB220.1
  Bottom 0.61: 18.82,62.51 U104.3 | 18.82,62.51 19.81,63.5 19.81,64.7 CB102.1 | v20.8,62.51 18.82,62.51 | CB220.1 v37.08,36.32
  pour Route15 (isolate 0.203): 1.52,77.98 18.8,77.98 30.48,66.29 36.07,66.29 37.85,64.52 37.85,50.29 33.78,46.23 4.06,46.23 1.02,49.28 1.02,77.47
  pour Route15 (isolate 0.203): 9.65,18.54 27.94,18.54 31.5,14.99 44.7,14.99 48.26,18.54 48.26,24.38 46.23,26.42 43.18,26.42 40.39,29.21 40.39,30.48 41.91,32 41.91,36.83 40.13,38.61 19.81,38.61 8.64,27.43 8.64,19.56
+12V  (1 unrouted)
  Top 0.406: FB201.1 11.43,7.37 10.41,8.38 10.41,28.7 14.1,32.38 14.1,33.91 CB201.+
  Top 0.813: U205.1 17.32,23.32 15.75,24.89 15.75,32.51 CB201.+
  Top 1.016: U205.1 20.55,22.84 19.56,21.84 19.56,20.76 CB208.1
  Top 1.778: FB202.P$1 15.49,35.31 CB201.+
  Bottom 0.61: 13.81,61.64 U104.1 14.2,62.76 13.46,63.5 13.46,64.7 CB101.1
  Bottom 0.813: 16.51,24.38 15.96,23.81 U204.1 | 16.51,24.38 16.7,24.57 CB207.1 | 16.51,24.38 16.51,28.19 15.75,28.96 14.41,28.96 CB202.1
  Bottom 1.778: CB202.1 13.4,29.27 13.21,29.46 11.58,29.46 CH3.P$4 11.41,29.69 14.22,32.51 CB201.+ | CH1.P$4 13.62,61.44 U104.1
+VIN  (via drill 0.38)
  Top 0.198: Q4.3 44.12,36.01 44.2,36.07 | Q4.5 44.92,35.85 44.83,35.94
  Top 1.778: FB202.P$2 CB203.+
  other vias: 44.2,36.32 45.21,36.32 42.93,37.34 43.94,37.34 44.96,37.34 45.97,37.34 46.99,37.34 48.01,37.34
  pour Top: 44.15,35.71 43.03,36.83 38.56,36.83 36.22,34.49 31.75,34.49 30.73,33.48 28.19,33.48 27.84,33.83 27.84,36.53 29.57,38.25 47.65,38.25 48.31,37.59 48.31,36.53 48.01,36.22 45.82,36.22 45.31,35.71
  pour Bottom (isolate 0.203, no thermals): 43.18,34.54 48.01,34.54 48.26,34.8 48.26,37.59 47.75,38.1 43.18,38.1 42.67,37.59 42.67,35.05
GND  (via drill 0.38, 0.6, 0.8 pad 1.27, 1, 3.05 pad 5.08)  (1 unrouted)
  Top 0.198: Q5.4 44.52,31.19 44.45,31.11 | Q5.2 43.72,31.16 43.79,31.09 | Q1.10 39.88,65.08 39.88,65.02 | Q1.8 39.88,64.28 39.88,64.39 | Q1.4 40.26,62.68 40.26,62.74 | Q1.6 39.88,63.48 39.88,63.5 | Q2.10 40.01,54.8 40.01,54.74 | Q2.8 40.01,55.6 40.01,55.63 | Q2.6 40.01,56.4 40.01,56.39 | Q2.4 40.01,57.2 40.01,57.28 | Q2.2 39.97,58 39.75,57.78
  Top 0.305: COMP1.6 12.88,59 v12.7,59.18
  Top 0.61: v37.34,61.21 CB107.2
  Bottom 0.406: v37.34,61.21 36.83,61.72 U101.5 | R109.1 v16.76,48.77
  Bottom 0.61: CB116.2 50.55,49.76
  Bottom 1.016: v3.81,67.06 TPA_IN.S2 | TPA_IN.S1 7.49,76.33 v7.62,76.2
  Bottom 1.778: CH2.P$1 50.55,49.76 48.54,49.76 v48.26,49.78
  other vias: 43.74,30.48 44.75,30.48 45.77,30.48 44.25,29.72 45.31,29.72 46.43,29.77 48.67,29.06 51.21,26.97 53.24,25.1 55.27,23.27 57,21.74 60.25,21.39 62.99,21.39 65.99,21.34 71.42,22.17 74.37,24.43 74.32,28.91 37.85,72.14 37.85,69.09 37.85,68.07 37.85,67.06 37.85,66.04 39.62,63.5 39.62,64.52 39.62,65.53 39.88,57.66 39.88,56.64 39.88,55.63 39.88,54.61 37.85,47.75 38.1,51.82 38.1,52.83 38.1,53.85 38.1,57.4 27.43,59.94 32.77,58.93 32.51,57.66 37.08,60.01 38.1,60.01 37.34,56.64 38.1,60.96 27.18,62.23 29.72,56.39 30.73,48.77 31.75,48.77 23.88,48.51 25.15,55.12 23.11,57.4 13.21,49.28 7.11,68.33 5.33,66.8 18.54,72.64 21.34,70.1 23.62,70.36 22.1,71.88 14.99,71.37 21.08,51.05 18.54,51.05 3.81,35.31 13.97,77.47 3.81,42.93 73.66,42.93 73.66,77.47 73.66,3.81 3.81,3.81 47.14,18.34 45.87,16.81 39.27,18.34 36.98,19.86 42.32,17.58 38.76,26.21 37.49,28.24 35.97,24.94 37.24,31.8 34.44,31.8 35.97,31.8 21.49,18.85 23.52,18.85 22.5,17.58 22,26.21 23.77,26.21 13.61,23.16 13.61,21.39 14.38,16.05 14.38,14.02 18.19,15.54 16.41,17.58 27.33,16.81 28.85,15.8 22.76,11.73 17.93,8.43 20.98,10.97 23.01,10.72 24.28,13 27.08,11.99 29.87,12.24 34.95,7.67 36.22,7.67 41.55,7.92 42.82,7.92 50.19,6.91 49.17,6.91 52.73,6.4 54,6.4 62.89,10.46 64.92,10.46 64.41,17.58 65.94,16.31 66.95,8.18 68.22,8.18 58.57,29.26 60.1,29.26 61.87,29.26 63.4,29.26 55.14,24.97 50.7,21.41 51.59,20.65 69.75,22.17 71.02,17.22 68.61,18.11 47.75,28.19 35.81,29.21 59.94,3.81 38.1,8.89 16.76,2.54 27.94,66.8 16,47.5 63.5,71.88 62.48,70.61 62.48,69.09 62.48,67.56 62.48,66.04 62.48,64.52 65.02,71.88 66.8,71.88 68.33,71.88 70.1,71.88 71.63,71.88 73.41,71.88 61.72,53.34 61.72,54.86 61.72,56.64 14.12,25.7 11.58,24.69 9.04,24.18 7.26,21.13 13.61,19.61 14.48,59.44 18.54,57.91 16.51,59.44 11.18,63.25 19.3,55.12 20.32,60.96 22.86,61.21 24.89,61.21 8.64,63.25 5.74,15.8 5.74,8.94 63.5,53.34 63.5,54.86 63.5,56.64 38.86,72.14 39.88,72.14 38.86,47.75 39.88,47.75 38.1,55.37 38.1,64.52
  pour Top (isolate 0.203, no thermals): 37.72,57.78 39.37,57.78 39.62,58.04 40.26,58.04 40.26,54.17 40.7,53.72 40.7,47.88 41.15,47.5 41.66,46.99 42.42,46.99 42.67,46.74 42.67,44.96 42.42,44.7 37.08,44.7 36.83,44.96 36.83,56.9
  pour Top (isolate 0.203, no thermals): 40.39,62.55 40.39,62.87 40.26,62.99 40.2,63.69 40.2,64.9 40.26,65.28 40.26,72.52 41.15,73.41 42.42,73.41 42.93,73.91 42.93,74.93 42.67,75.18 37.85,75.18 37.34,74.68 37.34,63.5 37.91,62.93 39.81,62.93 40.2,62.55
  pour Top (no thermals): 41.91,61.85 41.91,60.83 41.4,60.33 37.4,60.33 36.89,60.83 36.89,61.28 37.08,61.47 37.85,61.47 38.23,61.09 41.08,61.09 41.27,61.28 41.27,61.85
  pour Route2: 43.43,29.08 43.43,31.55 43.18,31.8 42.04,31.8 40.51,30.28 40.51,29.34 43.43,26.42 48.9,26.42 56.01,19.3 70.61,19.3 75.95,13.97 75.95,3.81 73.03,0.89 2.92,0.89 1.4,2.41 1.4,35.43 4.57,38.61 40.13,38.61 40.64,38.1 40.64,34.67 41.15,34.16 41.15,33.02 41.4,32.77 43.31,32.77 43.81,32.26 45.47,32.26 46.74,30.99 54.36,30.99 56.13,32.77 56.13,37.34 57.02,38.23 74.3,38.23 75.44,37.08 75.44,24.38 71.25,20.19 56.26,20.19 49.28,27.18 45.34,27.18
  pour Top (isolate 0.203, rank 3, no thermals): 43.48,31.7 43.74,31.7 43.74,31.29 43.84,31.19 50.85,31.19 51.16,30.89 57.45,30.89 58.01,31.45 64.87,31.45 66.4,32.97 74.73,32.97 75.44,32.26 75.44,24.38 71.22,20.17 56.29,20.17 49.28,27.18 45.36,27.18 43.28,29.26 43.28,31.5
  pour Top (isolate 0.254, rank 3): 1.52,80.26 32.26,80.26 34.04,78.49 34.04,41.66 32.26,39.88 3.3,39.88 1.02,42.16 1.02,79.76
  pour Bottom (isolate 0.203): 27.18,64.01 37.08,64.01 38.35,62.74 38.35,56.9 36.83,55.37 27.94,55.37 26.67,56.64 26.67,63.5
  pour Bottom (isolate 0.254): 13.21,67.06 25.4,67.06 26.16,66.29 26.16,61.47 25.4,60.71 21.59,60.71 21.08,60.2 21.08,55.37 19.3,53.59 12.95,53.59 11.68,54.86 11.94,61.72 11.94,65.79
  pour Route2 (isolate 0.203, rank 3): 1.52,80.26 75.18,80.26 76.71,78.74 76.71,71.63 74.93,69.85 66.55,69.85 65.28,68.58 65.28,52.58 67.56,50.29 75.18,50.29 76.71,48.77 76.71,42.67 74.42,40.39 2.79,40.39 1.02,42.16 1.02,79.76
  pour Bottom (isolate 0.203): 43.69,32.51 47.5,32.51 48.01,32 48.01,29.21 47.24,28.45 44.2,28.45 42.93,29.72 42.93,31.75 41.91,31.75 40.39,30.23 40.39,29.46 43.43,26.42 48.77,26.42 55.88,19.3 70.61,19.3 76.71,13.21 76.71,1.52 75.95,0.76 1.52,0.76 1.02,1.27 1.02,37.85 1.78,38.61 40.13,38.61 41.66,37.08 41.66,33.78 42.67,32.77 43.43,32.77
  pour Top (isolate 0.203, rank 3): 56.13,19.3 70.87,19.3 76.45,13.72 76.45,1.27 76.2,1.02 1.27,1.02 1.02,1.27 1.02,37.85 1.78,38.61 36.58,38.61 37.59,37.59 37.59,30.48 41.66,26.42 49.02,26.42
  pour Top: 74.68,69.85 65.79,69.85 64.26,68.33 64.26,62.74 64.01,62.48 62.23,62.48 61.98,62.74 61.98,71.63 62.99,72.64 75.44,72.64 75.69,72.39 75.69,70.87
  pour Bottom: 65.28,67.56 65.28,52.83 64.52,52.07 61.47,52.07 60.71,52.83 60.71,67.31 61.72,68.33 64.52,68.33
N$1
  Bottom 0.406: U101.3 35.05,63.16 R111.1
N$2  (via drill 0.38)
  Top 0.61: R112.1 36.01,62.36 v35.94,62.29
  Bottom 0.406: U101.4 35.85,62.2 v35.94,62.29 35.94,62.48 36.7,63.25 R111.2
N$3
  Bottom 0.406: 33.02,56.26 33.45,56.69 U101.10
  Bottom 0.61: R113.1 33.02,56.26
N$4  (via drill 0.38)
  Top 0.406: R114.1 36.58,58.93
  Bottom 0.406: U101.9 34.25,57.19 v34.16,57.09 34.16,56.83 R113.2
  pour Top (isolate 0.203, rank 2, no thermals): 37.59,59.44 37.59,58.17 35.94,56.52 33.91,56.52 33.53,56.9 33.53,57.4 33.91,57.78 34.67,57.78 36.45,59.56 37.47,59.56
N$5
  pour Top (isolate 0.203, rank 3, no thermals): 41.27,57.91 41.78,57.91 41.91,58.04 41.91,58.67 41.4,59.18 39.88,59.18 39.5,59.56 38.1,59.56 37.97,59.44 37.97,58.42 38.1,58.29 41.15,58.29 41.27,58.17
N$6
  pour Top (rank 2, no thermals): 41.02,61.47 38.99,61.47 38.86,61.59 38.86,62.48 38.99,62.61 39.75,62.61 40.45,61.91 40.96,61.91 41.02,61.85
N$7  (via drill 0.38)
  Top 0.406: CB107.1 34.46,61.3 34.54,61.21
  Top 0.61: 34.54,61.21 34.54,61.85 v34.1,62.29
  Bottom 0.406: U101.2 34.25,62.19 v34.1,62.29 33.11,63.28 R110.1
N$8
  Top 0.305: R107.2 9.97,59.18 10.16,59.18 10.92,59.94 13.21,59.94 13.53,59.62 COMP1.7 13.53,55.55 17.53,51.56 17.53,50.8 18.29,50.04 22.14,50.04 U102.1
N$9
  Top 0.406: POT1.2 27.63,49.59 26.42,50.8 26.42,52.39 POT1.3 26.2,52.61 U102.4
N$10
  Top 0.406: POT2.2 27.69,56.39 26.42,57.66 26.42,58.74 POT2.3 26.37,58.7 U103.4
N$11
  Top 0.406: R106.1 R102.2 18.54,67.31 | 18.54,67.31 R104.1 21.1,66.74 CB115.1 23.47,66.71 CB114.1 | 18.54,67.31 R105.2
N$12
  Top 0.305: U103.1 15.88,56.11 COMP1.8
N$13
  Top 0.305: COMP1.5 12.23,53.72 Q3.3 11.96,54.17 R108.2
N$14  (via drill 0.38)
  other vias: 71.88,68.33 70.87,68.33 70.87,67.06 71.88,67.06 71.88,65.79 70.87,65.79 70.87,64.52 71.88,64.52
  pour Bottom (rank 3): 76.2,51.82 76.2,67.82 75.44,68.58 66.55,68.58 65.79,67.82 65.79,52.58 67.31,51.05 75.44,51.05
  pour Top (no thermals): 76.45,61.98 66.29,61.98 65.28,62.99 65.02,62.99 64.77,63.25 64.77,68.07 66.04,69.34 75.95,69.34 76.71,68.58 76.71,62.23
N$15  (via drill 0.38)
  Top 0.305: v34.29,52.32 31.31,52.32 C102.1
  Top 0.406: POT1.1 29.09,52.71 29.21,52.58 31.18,52.58 C102.1
  Bottom 0.305: U101.6 36.65,54.69 v34.29,52.32
N$16
  Top 0.305: R107.1 9.97,61.21 13.21,61.21 13.53,61.54 COMP1.2 13.53,65.03 R106.2
N$17
  Top 0.305: COMP1.3 12.88,63.82 11.68,65.02 11.68,67.31 | 11.68,67.31 C101.2 10.86,66.8 R103.1 | 11.68,67.31 R102.1
N$18
  Top 0.406: C101.1 11.68,70.87 9.91,72.64 8.64,72.64 R101.1 8.06,73.15 TPA_IN.I
N$19  (via drill 0.38)
  Top 0.305: v23.11,51.31 U102.2 | v23.11,54.86 U103.2
  Top 0.406: Q3.1 11.63,51.35 CH4.P$3 10.92,52.39 v10.92,52.58
  Bottom 0.305: v23.11,54.86 v23.11,51.31 22.61,51.82 17.02,51.82 16.95,51.88 R109.2
  Bottom 0.406: R109.2 11.5,52 v10.92,52.58
N$20
  Bottom 1.778: CH3.P$2 7.95,26.24 7.11,25.4 4.6,25.4 12VIN.2
N$21
  Bottom 1.778: CH3.P$3 5.34,29.69 12VIN.1
N$22
  Bottom 1.778: CH2.P$3 57.63,46.76 58.93,45.47 58.93,43.31 VDIN.1
N$23
  Bottom 1.778: CH2.P$2 60.22,49.76 62.48,47.5 62.48,43.25 VDIN.2
N$24
  Top 0.198: Q2.3 42.29,57.6 42.29,57.53 | Q2.5 42.42,56.8 42.42,56.9 | Q2.7 42.42,56 42.42,56.01 | Q2.9 42.29,55.2 42.29,55.24 | Q2.11 42.29,54.4 42.29,54.36
  Top 1.93: 47.75,54.36 L104.P$1
  pour Top (isolate 0.203, rank 2, no thermals): 43.18,58.61 42.04,57.47 42.04,54.61 41.91,54.36 40.77,54.36 40.77,54.23 41.27,53.72 41.27,48.01 41.66,47.62 43.05,47.62 43.43,48.01 43.43,52.7 43.81,53.09 48.77,53.09 49.02,52.83 49.02,51.82 49.78,51.05 59.44,51.05 59.94,51.56 59.94,57.15 59.44,57.66 49.53,57.66 49.15,58.04 49.15,58.23 48.77,58.61
N$25  (via drill 0.38)
  Top 0.305: C103.1 31.24,55.12 32.26,54.1 v34.04,54.1
  Top 0.406: POT2.1 29.09,58.8 29.72,58.67 30.92,58.67 C103.1
  Bottom 0.305: U101.7 35.85,54.9 35.05,54.1 v34.04,54.1
N$26
  Top 0.198: Q1.7 42.29,63.88 | Q1.9 42.55,64.68 42.55,64.64 | Q1.11 42.29,65.48 42.29,65.53 | Q1.5 42.42,63.08 42.42,63.12 | Q1.3 42.42,62.28 42.42,62.36
  Top 1.93: L102.P$2 47.24,65.53
  pour Top (isolate 0.203, rank 2, no thermals): 42.93,61.34 42.04,62.23 42.04,65.41 41.91,65.53 40.77,65.53 40.77,72.14 41.15,72.52 43.31,72.52 43.56,72.26 43.56,67.31 43.94,66.93 48.9,66.93 49.28,67.31 49.28,68.83 49.78,69.34 59.44,69.34 59.94,68.83 59.94,62.74 59.69,62.48 49.28,62.48 48.9,62.1 48.9,61.85 48.39,61.34
N$27
  Top 1.016: CB110.P$1 38.73,76.83 38.61,76.96 | 41.66,76.96 CB111.1
  Top 1.778: L101.P$2 38.61,76.96 41.66,76.96 45.72,76.96 L102.P$1
N$28
  Top 1.016: CB113.1 41.66,43.69 41.91,43.43
  Top 1.778: L103.P$2 33.78,43.43 CB112.P$1 41.91,43.43 45.72,43.43 45.97,43.69 45.97,43.43 | 45.97,43.43 45.97,43.18 L104.P$2 45.97,43.43
N$29
  Top 1.778: C108.P$2 TPA_OUT.I
N$30
  Bottom 0.406: U201.3 40.01,36.49 R210.1
N$31
  Top 1.778: C108.P$1 66.93,54.74 T1.S2
N$32  (via drill 0.38)
  Top 0.406: v41.07,35.87 42.42,35.81 42.67,35.56
  Bottom 0.406: U201.4 40.8,35.6 v41.07,35.87 41.36,36.16 R210.2
  pour Top: 43.71,35.23 42.67,35.23 42.34,35.56 40.77,35.56 40.64,35.69 40.64,36.2 40.89,36.45 42.82,36.45 43.71,35.56
N$33
  Bottom 1.778: CH1.P$3 4.77,61.44 12VIN2.1
N$34
  Bottom 1.778: CH1.P$2 4.87,58.44 12VIN2.2
N$35
  Top 0.406: VSET.2 5.33,13.97 6.35,12.95 8.38,12.95 8.89,12.45 8.89,11.44 CH5.P$4
N$36
  Top 0.406: VSET.1 7.3,11.43 CH5.P$1
N$37
  Top 0.406: SHDN.2 7.11,20.32 8.89,18.54 8.89,17.79 CH6.P$4
N$38
  Top 0.406: SHDN.1 7.3,17.78 CH6.P$1
N$39
  Top 0.406: TPA_EN.2 6.41,51.82 CH4.P$4
N$40
  Top 0.406: CH4.P$1 6.82,49.75 6.35,49.28 TPA_EN.1
N$45
  Bottom 0.406: U201.10 38.41,30.75 R211.1
N$81  (via drill 0.38)
  Bottom 0.406: U201.9 39.2,30.77 v39.24,30.67 39.08,30.5 R211.2
  pour Top: 38.76,30.26 40.37,30.26 42.11,32 43.08,32 43.13,32.05 43.74,32.05 43.74,32.36 43.54,32.56 41.2,32.56 40.08,31.45 38.86,31.45 38.56,31.14 38.56,30.47
N$82  (via drill 0.38)
  Top 0.198: Q4.4 44.52,34.24 44.45,34.16 | Q4.2 43.72,34.38 43.94,34.16 | Q5.3 44.12,32.71 44.07,32.77 | Q5.5 44.92,32.6 44.96,32.64
  Top 0.406: CB219.2 v42.23,34.8
  Bottom 0.406: v42.23,34.8 41.98,34.8 U201.5
  other vias: 43.69,33.93 44.09,33.02 44.5,33.93 44.86,33.02 45.26,33.93
  pour Top (no thermals): 43.69,34.42 45.34,34.42 45.97,35.05 45.97,35.69 46.1,35.81 49.91,35.81 50.04,35.69 50.04,31.62 49.91,31.5 46.23,31.5 45.85,31.88 45.85,32.26 45.59,32.51 44.2,32.51 43.81,32.89 43.81,32.87 43.43,33.25 43.43,34.85 43.69,34.85
  pour Route2: 43.43,34.24 44.04,34.24 44.15,34.34 44.15,34.9 43.89,35.15 42.77,35.15 42.52,34.9 42.52,34.54 42.32,34.34 41.71,34.34 41.5,34.54 41.5,35.41 42.11,36.02 49.33,36.02 49.73,35.61 49.73,32 49.23,31.5 46.84,31.5 45.62,32.72 44.04,32.72 43.43,33.32
N$83  (via drill 0.38)
  Top 0.305: 36.32,27.18 v40.13,27.18 | 36.32,27.18 36.32,26.36 POT4.1 | v35.05,27.56 35.94,27.56 36.32,27.18
  Bottom 0.305: U201.7 40.8,28.4 C205.1 40.6,27.65 v40.13,27.18 | D203.A 34.47,26.6 35.05,27.18 v35.05,27.56
N$84  (via drill 0.38)
  Top 0.305: POT3.1 43.56,26.29 v42.55,27.3
  Bottom 0.305: U201.6 41.6,29.13 41.91,28.83 41.91,27.43 | 41.91,27.43 41.91,26.2 C204.1 41.53,25.82 D202.A | v42.55,27.3 42.04,27.3 41.91,27.43
N$85  (via drill 0.38)
  Top 0.305: v38.35,23.24 36.5,23.24 POT4.3 | POT4.2 39.19,24.07 v38.35,23.24 | U203.4 38.03,21.4 38.35,21.72 v38.35,23.24
  Bottom 0.305: R209.2 37.65,22.54 v38.35,23.24
N$86  (via drill 0.38)
  Top 0.406: v38.99,35.94 39.37,35.56 39.37,34.8 CB219.1
  Bottom 0.406: U201.2 39.2,35.73 v38.99,35.94
N$87  (via drill 0.38)
  Top 0.305: OP2.1 46.25,8.22 R218.2 44.13,8.07 43.43,8.76 43.43,9.72 C208.1 41.72,9.85 v41.66,9.91 | 22.35,13.21 v22.48,13.21 22.42,13.15 PWM.2
  Bottom 0.305: v41.66,9.91 25.78,9.91 v22.48,13.21
N$88
  Top 0.305: C208.2 43.31,12.83 44.45,13.97 46.04,13.97 C207.2 49.47,14.03 51.44,12.06 51.44,10.9 OP2.4 52.55,10.83 R216.2 53.53,13.59 R217.2
N$89
  Top 0.305: R218.1 C207.1
N$90
  Top 0.305: R216.1 C206.1
N$91
  Top 0.305: R217.1 57.66,14.86 59.31,13.21 59.31,11.88 C206.2 59.33,11.9 OP1.1 62.93,12.51 63.63,13.21 64.39,13.21 64.77,13.59 64.77,14.45 OP1.4
N$92
  Top 1.27: CB213.2 R213.2
N$93  (via drill 0.38)
  Top 0.305: R214.2 67.56,18.8 v68.58,19.81
  Bottom 0.305: v68.58,19.81 68.58,29.94 VDOUT.2
  pour Top (isolate 0.203): 56.39,33.4 74.42,33.4 75.69,34.67 75.69,36.7 74.04,38.35 58.42,38.35 56.13,36.07 51.69,36.07 51.44,35.81 51.44,31.5 51.69,31.24 55.5,31.24 55.75,31.5 55.75,32.77
N$94
  Top 0.305: OP1.3 67.28,11.9 R215.2 R214.1
N$96
  Top 0.305: R220.2 35.75,4.06 C209.1 35.62,4.06 R219.1
N$97
  Top 1.27: CB212.2 R212.2
N$104
  Top 0.305: 29.21,4.06 10.92,4.06 8.93,6.06 CH5.P$3 | 29.21,4.06 R219.2 | 29.21,4.06 R221.1
N$107
  Top 0.305: D201.A 43.05,16.38 44.07,17.4 44.07,18.33 U202.1 U202.2 | U203.1 36.13,16.5 D201.A | R207.1 37.02,15.61 D201.A
N$108
  Top 0.305: R205.2 25.59,11.68 PWM.5 27.51,10.1 C202.1
N$109
  Top 0.305: PWM.3 18.79,12.5 C201.1 R203.2 R202.1
  Top 0.406: R203.2 R204.1
N$111
  Top 0.305: R206.2 C203.1 28.32,13.59 27.89,13.15 PWM.7
N$112
  Top 0.305: R207.2 C203.2 R206.1
N$113  (via drill 0.38)
  Top 0.305: v11.94,9.91 13.4,9.91 R202.2
  Bottom 0.305: Q6.3 11.68,10.16 v11.94,9.91
N$114
  Top 0.406: FB201.2 16.38,7.37 | 16.38,7.37 21.02,7.37 CB221.1 23.18,7.69 23.62,8.13 23.62,9.21 R205.1 | R203.1 16.26,7.49 16.38,7.37
N$116
  Bottom 0.305: D203.C 34.16,23.18 R209.1
N$117
  Bottom 0.305: D202.C 43.55,21.16 R208.1
N$129  (via drill 0.38)
  Top 0.305: 45.59,23.5 45.72,23.5 46.35,22.86 v46.35,22.73 46.35,21.59 45.91,21.14 U202.4 | 45.59,23.5 POT3.3 | POT3.2 46.99,24.89 45.59,23.5
  Bottom 0.305: R208.2 45.53,21.91 v46.35,22.73
N$135  (via drill 0.38)
  Top 0.305: PWM.1 20.23,13.8 v19.81,14.22 | U203.2 37.08,17.78 v37.59,17.27
  Top 0.406: CH6.P$3 8.93,16.04 v9.14,16.26
  Bottom 0.305: Q6.1 R201.2 10.67,16.26 12.19,17.78 14.48,17.78 18.03,14.22 v19.81,14.22 26.92,14.22 27.69,14.99 35.31,14.99 v37.59,17.27
  Bottom 0.406: v9.14,16.26 10.35,16.26 R201.2
OP2
  Top 0.305: OP2.3 51.37,6.67 49.09,4.38 C210.1 40.26,4.38 R220.1
VCC  (via drill 0.6, 1 pad 1.27)
  Top 0.305: PWM.8 25.76,15.43
  Top 0.406: OP1.5 62.93,16.1 CB216.1 | 25.76,15.43 CB214.1
  Top 0.61: CB214.1 v24.38,15.49 | v49.28,12.45 49.47,12.25 OP2.5 49.47,10.22 50.04,9.65 51.82,9.65 52.11,9.36 CB215.1 | OP1.5 61.5,14.51 v61.47,14.48
  Bottom 0.813: CB209.1 16.72,18.86 U204.3
  Bottom 1.016: CB209.1 18.67,17.14 v19.05,16.76
  pour Route15 (isolate 0.203): 7.87,7.62 7.87,16 9.65,17.78 27.18,17.78 30.73,14.22 45.47,14.22 49.02,17.78 67.82,17.78 69.6,16 69.6,3.56 67.31,1.27 14.22,1.27
VDRAIN  (via drill 1.3)
  Top 2.54: L103.P$1 v26.16,43.18 | v25.91,76.96 L101.P$1
  Bottom 0.61: CB116.1 50.55,47.01 50.8,46.76
  Bottom 1.778: v25.91,76.96 43.94,76.96 45.47,75.44 45.47,47.01 45.21,46.76 | CH2.P$4 50.8,46.76 45.21,46.76 | v26.16,43.18 37.34,43.18 40.92,46.76 45.21,46.76